# Altium schematic sheet [CC2538] RTC.SchDoc
size 254 x 208 mm
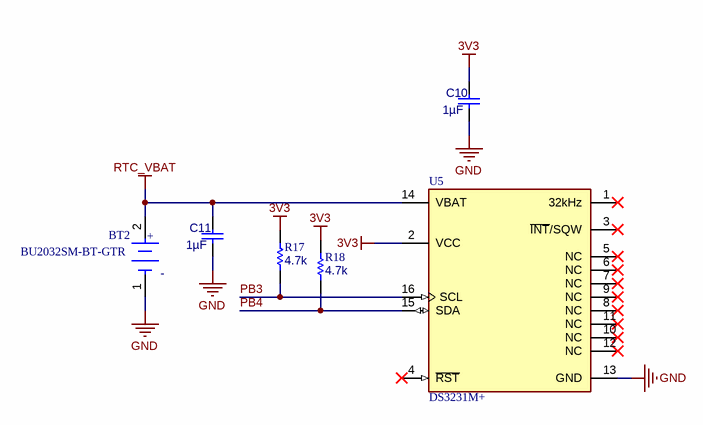
[diagram p0: [CC2538] RTC.SchDoc]

## Parts
BT2  BU2032SM-BT-GTR  [FP-BU2032SM-BT-GTR-MFG]
C10  value 1µF  [CAP_0603]  (hidden comment: 0106031051016)
C11  value 1µF  [CAP_0603]  (hidden comment: 0106031051016)
R17  value 4.7k  [RES_0603]  (hidden comment: 0006034721)
R18  value 4.7k  [RES_0603]  (hidden comment: 0006034721)
U5  DS3231M+  [FP-W16MK-1-IPC_B]

## Nets
3V3: C10.2 R17.2 R18.2 U5.2(VCC)
GND: BT2.1(C) C10.1 C11.1 U5.13(GND)
RTC_VBAT: BT2.2(A) C11.2 U5.14(VBAT)
PB3: R17.1 U5.16(SCL)
PB4: R18.1 U5.15(SDA)

Not connected (* = marked no-connect by the designer): U5 1(32kHz)* 3(~{INT}/SQW)* 4(~{RST})* 5(NC)* 6(NC)* 7(NC)* 8(NC)* 9(NC)* 10(NC)* 11(NC)* 12(NC)*

## Notes on the sheet
- Title
- Size
- Date:
- A4
- Number
- Check by:
- Revision
- Sheet of:
- Draw by:
- (in symbol CMP-00029-00009-1) +; -

## Library data of the parts
BT2 = CMP-00029-00009-1: Batteries/Accessories
C10 C11 = CMP-001-00177-2: CAP, size 0603, 1 uF, 16 VDC, 10%; Manufacturer Part Number: CL10B105KO8NNWC; Manufacturer: Samsung Electro-Mechanics; Voltage Rating DC: 16 VDC; Component Type: Standard; Supplier 3 URL: https://www.thegioiic.com/tu-gom-0603-1uf-16v; Operating Temperature Max: + 85 C; Tolerance: 10%; Supplier 3 Part Number: N/A; Source: Capacitor_0603_10_percent.SchLib; Case/Package: 0603; Supplier 1 Part Number: 187-CL10B105KO8NNWC; Operating Temperature Min: - 40 C; Packaging: Tape and Reel; Design Item ID: 0106031051016; LCSC Part #: C1592; Supplier 2 Part Number: 1276-CL10B105KO8NNWCTR-ND; Supplier 2 URL: https://www.digikey.com/en/products/detail/samsung-electro-mechanics/cl10b105ko8nnwc/16572783; Supplier 1 URL: https://www.mouser.vn/ProductDetail/Samsung-Electro-Mechanics/CL10B105KO8NNWC?qs=81r%252BiQLm7BT%252BXtc72qn1ug%3D%3D&utm_source=mouser-refine-download&utm_medium=file&utm_campaign=CL10B105KO8NNWC&utm_content=Samsung-Electro-Mechanics; ComponentLink1URL: https://www.mouser.vn/datasheet/2/585/Samsung_MLCC_1837944-1929650.pdf; Pins: 2; Mount: SMD/SMT; ComponentLink1Description: Datasheet
R17 R18 = CMP-009-00346-4: RES, size 0603, 4.7 kOhm, 1/10 W, 1%; Manufacturer Part Number: RC0603FR-074K7L; Manufacturer: YAGEO; Rated Power: 1/10 W; Design Item ID: 0006034721; Supplier 1 URL: https://www.mouser.vn/ProductDetail/YAGEO/RC0603FR-074K7L?qs=gt6vzsuosg37y0l7Vt36bQ%3D%3D; Source: Resistor_0603.SchLib; Supplier 2 URL: N/A; LCSC Part #: C99782; Supplier 2 Part Number: N/A; Supplier 1 Part Number: 603-RC0603FR-074K7L; Pins: 2; Packaging: Tape and Reel; ComponentLink1URL: https://www.mouser.vn/datasheet/2/447/YAGEO_PYu_RC_Group_51_RoHS_L_12-3313492.pdf; Supplier 3 Part Number: N/A; Component Type: Standard; Operating Temperature Max: + 85 C; Supplier 3 URL: N/A; Operating Temperature Min: - 40 C; Case/Package: 0603; ComponentLink1Description: Datasheet; Tolerance: 1%; Mount: SMD/SMT
U5 = CMP-00023-00003-1: Real Time Clock, Non-Volatile, 1 Timer(s), CMOS, PDSO16; Case/Package: SOP; Max Operating Temperature: 85°C; RoHS Compliant: Yes; Min Operating Temperature: -40°C; Pins: 16